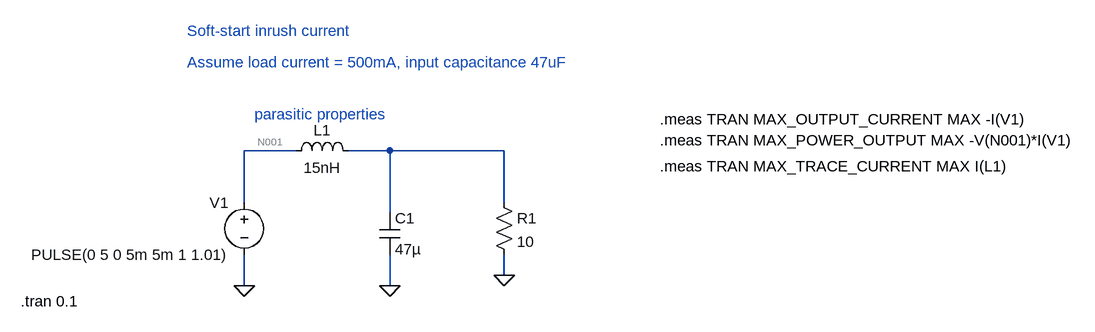
[diagram p0: schematic Draft1.asc]
Draft1.asc, the LTspice schematic file:
Version 4.1
SHEET 1 1464 680
WIRE 240 48 160 48
WIRE 384 48 320 48
WIRE 560 48 384 48
WIRE 160 128 160 48
WIRE 560 128 560 48
WIRE 384 144 384 48
WIRE 560 240 560 208
WIRE 160 256 160 208
WIRE 384 256 384 208
FLAG 160 256 0
FLAG 560 240 0
FLAG 384 256 0
SYMBOL voltage 160 112 M0
WINDOW 123 0 0 Left 0
WINDOW 39 0 0 Left 0
SYMATTR InstName V1
SYMATTR Value PULSE(0 5 0 5m 5m 1 1.01)
SYMBOL cap 368 144 R0
SYMATTR InstName C1
SYMATTR Value 47µ
SYMATTR SpiceLine V=6.3 Irms=15.3 Rser=0.003245 Lser=10nH
SYMBOL res 544 112 R0
SYMATTR InstName R1
SYMATTR Value 10
SYMBOL ind 224 64 R270
WINDOW 0 32 56 VTop 2
WINDOW 3 5 56 VBottom 2
SYMATTR InstName L1
SYMATTR Value 15nH
SYMATTR SpiceLine Rser=40m Cpar=10pF
TEXT 72 -136 Left 2 ;Soft-start inrush current
TEXT 72 -88 Left 2 ;Assume load current = 500mA, input capacitance 47uF
TEXT -184 280 Left 2 !.tran 0.1
TEXT 176 -8 Left 2 ;parasitic properties
TEXT 800 0 Left 2 !.meas TRAN MAX_OUTPUT_CURRENT MAX -I(V1)
TEXT 800 32 Left 2 !.meas TRAN MAX_POWER_OUTPUT MAX -V(N001)*I(V1)
TEXT 800 72 Left 2 !.meas TRAN MAX_TRACE_CURRENT MAX I(L1)

The netlist it stands for:
* Draft1.asc
V1 N001 0 PULSE(0 5 0 5m 5m 1 1.01)
C1 N002 0 47µ V=6.3 Irms=15.3 Rser=0.003245 Lser=10nH
R1 N002 0 10
L1 N001 N002 15nH Rser=40m Cpar=10pF
* Soft-start inrush current
* Assume load current = 500mA, input capacitance 47uF
.tran 0.1
* parasitic properties
.meas TRAN MAX_OUTPUT_CURRENT MAX -I(V1)
.meas TRAN MAX_POWER_OUTPUT MAX -V(N001)*I(V1)
.meas TRAN MAX_TRACE_CURRENT MAX I(L1)
.backanno
.end